# EAGLE design ZephMultiples (EAGLE 6.5.0)
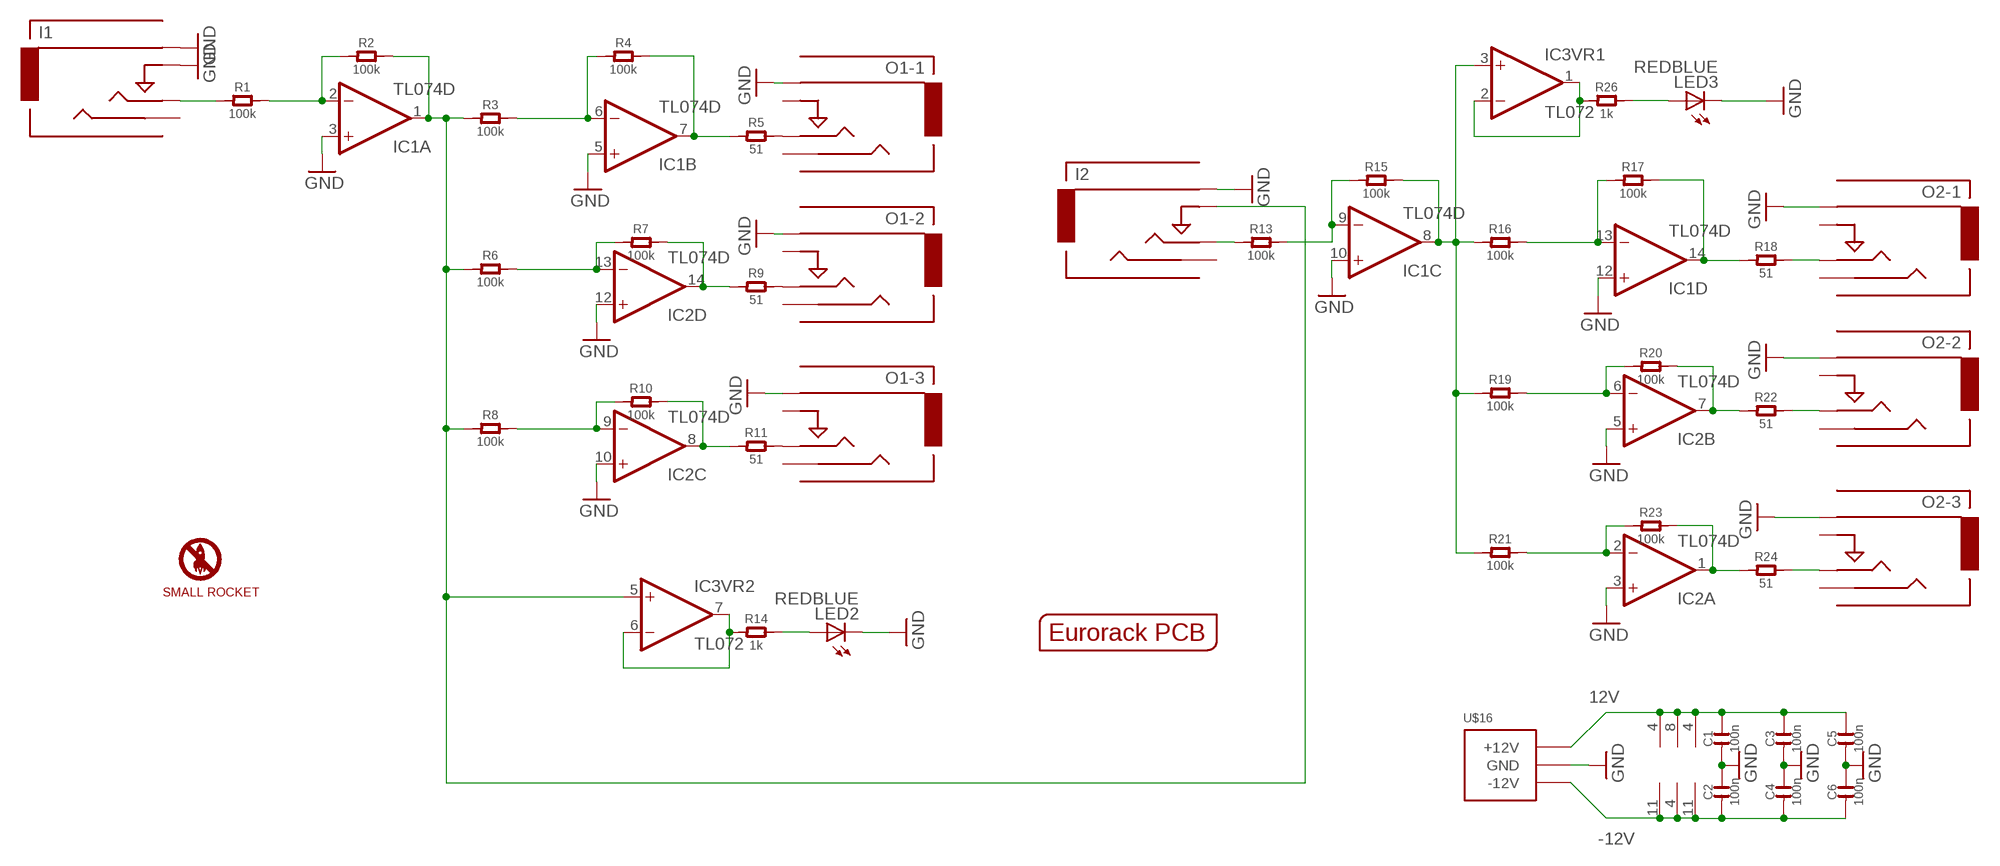
[diagram p0: schematic, sheet 1]

## Parts
C1  100n  C-0603  [C0603]
C2  100n  C-0603  [C0603]
C3  100n  C-0603  [C0603]
C4  100n  C-0603  [C0603]
C5  100n  C-0603  [C0603]
C6  100n  C-0603  [C0603]
I1  In 1  AUDIO-JACKINPUT  [3.5MM-JACK-SWITCH-13MM-INPUT]
I2  In 2  AUDIO-JACKINPUT  [3.5MM-JACK-SWITCH-13MM-INPUT]
IC1  TL074D  [SO14]
IC2  TL074D  [SO14]
IC3  TL072  [SO08]
LED2  REDBLUE  LED3MM  [LED3MM]
LED3  REDBLUE  LED3MM  [LED3MM]
O1-1  AUDIO-JACKOUTPUT  [3.5MM-JACK-SWITCH-13MM-OUTPUT]
O1-2  AUDIO-JACKOUTPUT  [3.5MM-JACK-SWITCH-13MM-OUTPUT]
O1-3  AUDIO-JACKOUTPUT  [3.5MM-JACK-SWITCH-13MM-OUTPUT]
O2-1  AUDIO-JACKOUTPUT  [3.5MM-JACK-SWITCH-13MM-OUTPUT]
O2-2  AUDIO-JACKOUTPUT  [3.5MM-JACK-SWITCH-13MM-OUTPUT]
O2-3  AUDIO-JACKOUTPUT  [3.5MM-JACK-SWITCH-13MM-OUTPUT]
R1  100k  R-0603  [R0603]
R2  100k  R-0603  [R0603]
R3  100k  R-0603  [R0603]
R4  100k  R-0603  [R0603]
R5  51  R-0603  [R0603]
R6  100k  R-0603  [R0603]
R7  100k  R-0603  [R0603]
R8  100k  R-0603  [R0603]
R9  51  R-0603  [R0603]
R10  100k  R-0603  [R0603]
R11  51  R-0603  [R0603]
R13  100k  R-0603  [R0603]
R14  1k  R-0603  [R0603]
R15  100k  R-0603  [R0603]
R16  100k  R-0603  [R0603]
R17  100k  R-0603  [R0603]
R18  51  R-0603  [R0603]
R19  100k  R-0603  [R0603]
R20  100k  R-0603  [R0603]
R21  100k  R-0603  [R0603]
R22  51  R-0603  [R0603]
R23  100k  R-0603  [R0603]
R24  51  R-0603  [R0603]
R26  1k  R-0603  [R0603]
U$1  SMALLROCKET  [SMALLROCKET]
U$15  EURORACK_PCB4HP  [EURORACK4HPPCB]
U$16  POWER_SIMPLE10-OTHERSIDE  [POWER_10_LABELSOTHERSIDE]

## Nets
12V: C1.2 C3.2 C5.2 IC1.4(P:V+) IC2.4(P:V+) IC3.8(VR3:V+) U$16.9(+12V) U$16.10(+12V)
-12V: C2.1 C4.1 C6.1 IC1.11(P:V-) IC2.11(P:V-) IC3.4(VR3:V-) U$16.1(-12V) U$16.2(-12V)
GND: C1.1 C2.2 C3.1 C4.2 C5.1 C6.2 I1.RING@1(RING) I1.RING@2(RING) I1.SWITCH@1(SWITCH) I1.SWITCH@2(SWITCH) I2.RING@1(RING) I2.RING@2(RING) IC1.3(A:+IN) IC1.5(B:+IN) IC1.10(C:+IN) IC1.12(D:+IN) IC2.3(A:+IN) IC2.5(B:+IN) IC2.10(C:+IN) IC2.12(D:+IN) LED2.K(C) LED3.K(C) O1-1.RING@1(RING) O1-1.RING@2(RING) O1-2.RING@1(RING) O1-2.RING@2(RING) O1-3.RING@1(RING) O1-3.RING@2(RING) O2-1.RING@1(RING) O2-1.RING@2(RING) O2-2.RING@1(RING) O2-2.RING@2(RING) O2-3.RING@1(RING) O2-3.RING@2(RING) U$16.3(GND) U$16.4(GND) U$16.5(GND) U$16.6(GND) U$16.7(GND) U$16.8(GND)
LED2DRIVE: IC3.6(VR2:-IN) IC3.7(VR2:OUT) R14.1
LED3DRIVE: IC3.1(VR1:OUT) IC3.2(VR1:-IN) R26.1
N$1: I1.TIP@1(TIP) I1.TIP@2(TIP) R1.1
N$2: IC1.2(A:-IN) R1.2 R2.1
N$3: I2.SWITCH@1(SWITCH) I2.SWITCH@2(SWITCH) IC1.1(A:OUT) IC3.5(VR2:+IN) R2.2 R3.1 R6.1 R8.1
N$4: IC1.6(B:-IN) R3.2 R4.1
N$5: IC1.7(B:OUT) R4.2 R5.1
N$6: IC2.13(D:-IN) R6.2 R7.1
N$7: IC2.9(C:-IN) R8.2 R10.1
N$8: IC2.14(D:OUT) R7.2 R9.1
N$9: IC2.8(C:OUT) R10.2 R11.1
N$11: O1-1.TIP@1(TIP) O1-1.TIP@2(TIP) R5.2
N$12: O1-2.TIP@1(TIP) O1-2.TIP@2(TIP) R9.2
N$13: O1-3.TIP@1(TIP) O1-3.TIP@2(TIP) R11.2
N$14: I2.TIP@1(TIP) I2.TIP@2(TIP) R13.1
N$15: IC1.9(C:-IN) R13.2 R15.1
N$16: IC1.8(C:OUT) IC3.3(VR1:+IN) R15.2 R16.1 R19.1 R21.1
N$17: IC1.13(D:-IN) R16.2 R17.1
N$18: IC1.14(D:OUT) R17.2 R18.1
N$19: IC2.6(B:-IN) R19.2 R20.1
N$20: IC2.2(A:-IN) R21.2 R23.1
N$21: IC2.7(B:OUT) R20.2 R22.1
N$22: IC2.1(A:OUT) R23.2 R24.1
N$24: O2-1.TIP@1(TIP) O2-1.TIP@2(TIP) R18.2
N$25: O2-2.TIP@1(TIP) O2-2.TIP@2(TIP) R22.2
N$26: O2-3.TIP@1(TIP) O2-3.TIP@2(TIP) R24.2
N$29: LED2.A R14.2
N$30: LED3.A R26.2
Unconnected: I1.SECOND@1(SECOND) I1.SECOND@2(SECOND) I2.SECOND@1(SECOND) I2.SECOND@2(SECOND) O1-1.SECOND@1(SECOND) O1-1.SECOND@2(SECOND) O1-1.SWITCH@1(SWITCH) O1-1.SWITCH@2(SWITCH) O1-2.SECOND@1(SECOND) O1-2.SECOND@2(SECOND) O1-2.SWITCH@1(SWITCH) O1-2.SWITCH@2(SWITCH) O1-3.SECOND@1(SECOND) O1-3.SECOND@2(SECOND) O1-3.SWITCH@1(SWITCH) O1-3.SWITCH@2(SWITCH) O2-1.SECOND@1(SECOND) O2-1.SECOND@2(SECOND) O2-1.SWITCH@1(SWITCH) O2-1.SWITCH@2(SWITCH) O2-2.SECOND@1(SECOND) O2-2.SECOND@2(SECOND) O2-2.SWITCH@1(SWITCH) O2-2.SWITCH@2(SWITCH) O2-3.SECOND@1(SECOND) O2-3.SECOND@2(SECOND) O2-3.SWITCH@1(SWITCH) O2-3.SWITCH@2(SWITCH)

## Library data of the parts
C1-C6 = OPL:C*
I1 I2 O1-1-O1-3 O2-1-O2-3 = EurorackModularParts:AUDIO-JACK: Switching Mono 3.5mm Audio Jack from Erthenvar.
IC1 IC2 = EurorackModularParts:TL074: OP AMP
IC3 = EurorackModularParts:TL072
LED2 LED3 = SparkFun-LED:LED: LEDs Standard schematic elements and footprints for 5mm, 3mm, 1206, and 0603 sized LEDs. 5mm - Spark Fun Electronics SKU : COM-00529 (and others)
R1-R11 R13-R24 R26 = OPL:R*
U$1 = zephod-components:SMALLROCKET
U$15 = EurorackModularParts:EURORACK_PCB
U$16 = EurorackModularParts:POWER_SIMPLE

## Net classes
1 AUDIO: width 1.016 mm

## Board
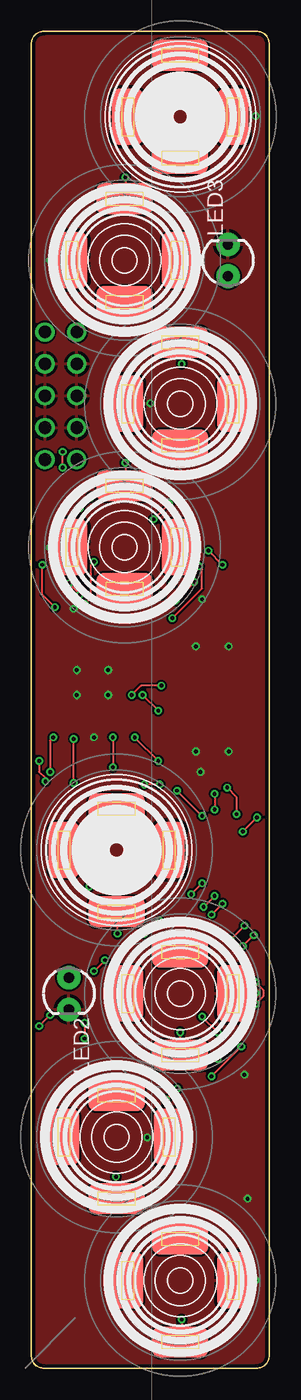
[diagram p1: board, top side]
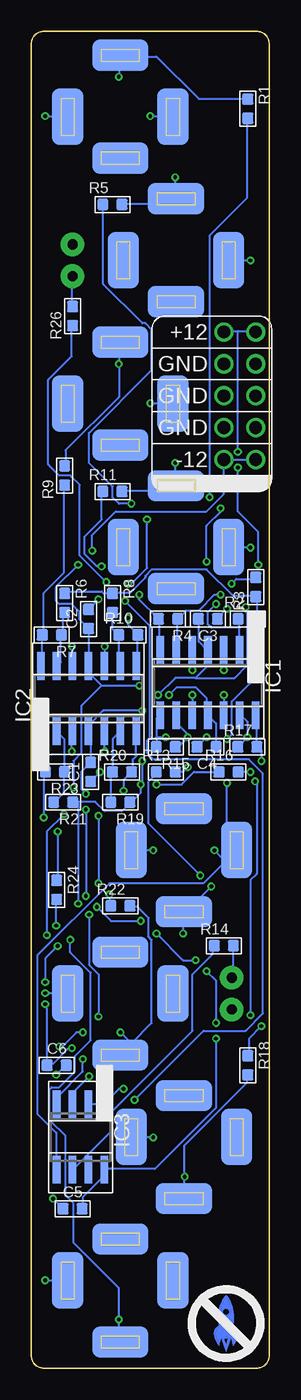
[diagram p2: board, bottom side, seen from below]

Size 18.98 x 106.5 mm. Coordinates in mm from the lower left corner, seen from the top.
Copper layers (1*16): Top 0.035mm / dielectric 1.5mm / Bottom 0.035mm
Design rules "ITEADstudio_DRC": minimum track width 6mil, minimum drill 12mil, track to track 6mil, track to pad 6mil, pad to pad 6mil, via to via 6mil, smd to smd 0mil, copper to edge 10mil, drill to drill 10mil, minimum pad ring 10mil, minimum via ring 6mil, stop-mask expansion 2mil, vias tented up to drill 100mil, thermal gap 10mil

### Footprints (pad centres in the part's own frame; a part is rotated, then mirrored left to right if it is on the bottom)
C0603 = smd 0.889 x 0.889: 1 -0.762,0; 2 0.762,0
3.5MM-JACK-SWITCH-13MM-INPUT = smd 2.5 x 4.5: RING@1 -4.2,0; SWITCH@1 4.2,0 | smd 2.5 x 4.5 bottom: RING@2 -4.2,0; SWITCH@2 4.2,0 | smd 4.5 x 2.5: SECOND@1 0,-3.3; TIP@1 0,4.9 | smd 4.5 x 2.5 bottom: SECOND@2 0,-3.3; TIP@2 0,4.9
SO14 = smd 0.6 x 2.2: 1 -3.81,-2.6; 2 -2.54,-2.6; 3 -1.27,-2.6; 4 0,-2.6; 5 1.27,-2.6; 6 2.54,-2.6; 7 3.81,-2.6; 8 3.81,2.6; 9 2.54,2.6; 10 1.27,2.6; 11 0,2.6; 12 -1.27,2.6; 13 -2.54,2.6; 14 -3.81,2.6
SO08 = smd 0.6 x 2.2: 1 -1.905,-2.6; 2 -0.635,-2.6; 3 0.635,-2.6; 4 1.905,-2.6; 5 1.905,2.6; 6 0.635,2.6; 7 -0.635,2.6; 8 -1.905,2.6
LED3MM = drill 0.813 pad 1.88: A -1.27,0; K 1.27,0
3.5MM-JACK-SWITCH-13MM-OUTPUT = smd 2.5 x 4.5: RING@1 -4.2,0; SWITCH@1 4.2,0 | smd 2.5 x 4.5 bottom: RING@2 -4.2,0; SWITCH@2 4.2,0 | smd 4.5 x 2.5: SECOND@1 0,-3.3; TIP@1 0,4.9 | smd 4.5 x 2.5 bottom: SECOND@2 0,-3.3; TIP@2 0,4.9
R0603 = smd 0.889 x 0.889: 1 -0.762,0; 2 0.762,0
POWER_10_LABELSOTHERSIDE = drill 1.016: 1 -5.08,-1.27; 2 -5.08,1.27; 3 -2.54,-1.27; 4 -2.54,1.27; 5 0,-1.27; 6 0,1.27; 7 2.54,-1.27; 8 2.54,1.27; 9 5.08,-1.27; 10 5.08,1.27

### Placement (x,y rotation side)
C1  14.25,47.5 90 bottom
C2  14.42,59.69 90 bottom
C3  4.89,59.69 180 bottom
C4  5,49.5 180 bottom
C5  15.69,12.7 0 bottom
C6  16.96,24.13 0 bottom
I1  11.88,99.69 0 top
I2  6.8,41.27 180 top
IC1  4.89,54.61 180 bottom
IC2  14.42,53.34 0 bottom
IC3  15.05,18.41 180 bottom
LED2  2.99,29.84 270 top
LED3  15.69,88.27 90 top
O1-1  7.44,88.27 0 top
O1-2  11.88,76.83 0 top
O1-3  7.44,65.41 0 top
O2-1  6.8,18.41 180 top
O2-2  11.88,29.84 180 top
O2-3  11.88,6.99 180 top
R1  1.72,100.33 270 bottom
R2  1.72,59.69 0 bottom
R3  1.09,62.23 90 bottom
R4  8.07,59.69 180 bottom
R5  12.52,92.71 0 bottom
R6  16.32,60.96 270 bottom
R7  17.34,58.42 180 bottom
R8  12.52,60.96 270 bottom
R9  16.32,71.12 90 bottom
R10  11.24,58.42 0 bottom
R11  12.52,69.85 0 bottom
R13  8.25,47.5 0 bottom
R14  3.62,33.66 0 bottom
R15  8.25,49.5 180 bottom
R16  3.25,47.5 0 bottom
R17  1.75,49.5 0 bottom
R18  1.72,24.13 270 bottom
R19  11.88,45.09 180 bottom
R20  11.75,47.5 0 bottom
R21  16.44,45.09 180 bottom
R22  11.88,36.83 0 bottom
R23  17.09,47.51 180 bottom
R24  16.96,38.1 270 bottom
R26  15.69,83.82 90 bottom
U$1  3.75,3.25 0 bottom
U$15  -0.5,0 0 top
U$16  2.36,77.47 90 bottom

### Tracks (layer width: path | path; a pad name or v marks a point on that pad's centre or on a via)
12V  (via drill 0.3)
  Top 0.152: v8.88,53.62 v10.12,52.38 | v4.25,27.5 v4.25,26.25 | v5.88,32.5 v5,31.62 | v9,34.62 9.25,34.62 v10.25,35.62 | v14.62,37.62 v13.75,36.75 | v14.62,45.75 v14.62,44.5 | v2.5,71.75 v2.5,73 | v0.88,64 0.88,61.62 v1.88,60.62
  Bottom 0.152: 2.5,82.62 3.62,82.62 U$16.10 | 2.5,82.62 1.12,82.62 U$16.9 | C5.2 14.88,12.75 14.88,13.62 13.25,15.25 13.25,15.75 IC3.8 13.12,15.88 9.12,15.88 4.25,20.75 v4.25,26.25 | C3.2 5.62,59.62 5.62,57.88 5,57.25 IC1.4 5,57.12 5,55.88 5.88,55 | v10.12,52.38 13.25,52.38 14.38,51.25 14.38,50.75 IC2.4 14.38,50.62 14.25,50.5 C1.2 15,47.5 15,46.12 v14.62,45.75 | v8.88,53.62 7.5,55 5.88,55 | v4.25,27.5 4.25,30.88 v5,31.62 | v5.88,32.5 6.88,32.5 v9,34.62 | v10.25,35.62 12.62,35.62 v13.75,36.75 | v14.62,44.5 v14.62,37.62 | v2.5,73 2.5,82.62 | v2.5,71.75 2.5,68.25 0.88,66.62 v0.88,64 | v1.88,60.62 1.88,60.25 1.75,60.12 1.75,56 2.75,55 5.88,55
-12V  (via drill 0.3)
  Top 0.152: v14.88,24.62 v15.75,25.5 | v8,53.62 8.75,54.38 v10.38,54.38 | v17.88,29 18.5,29.62 18.5,30.12 v17.88,30.75 | v17.75,34.5 v16.88,33.62 | v16.38,44.12 16.38,45.5 v15.62,46.25 | v15.25,64 v14.12,65.12
  Bottom 0.152: 3.62,72.38 1.12,72.38 U$16.1 | v15.75,25.5 16,25.5 17.25,24.25 17.62,24.25 C6.1 17.75,24.25 17.75,28.88 v17.88,29 | v14.88,24.62 14.88,23.62 16.88,21.62 16.88,21.12 IC3.4 | C4.1 4.25,51.38 4.88,52 IC1.11 5,52.12 5,53.38 5.88,54.25 7.38,54.25 v8,53.62 | 13.38,54.38 v10.38,54.38 | 13.38,54.38 14.38,55.38 14.38,55.88 IC2.11 14.38,56 14.38,58.88 C2.1 14.5,59 15.12,59.62 15.12,60.25 15.75,60.88 16.75,60.88 17,61.12 17,62.25 v15.25,64 | v17.88,30.75 17.88,32.62 v16.88,33.62 | v17.75,34.5 17.75,42.75 v16.38,44.12 | v15.62,46.25 15.62,48.38 15,49 15,52.75 13.38,54.38 | 3.62,72.38 3.62,69.62 5,68.25 12.25,68.25 14.12,66.38 v14.12,65.12 | 3.62,72.38 U$16.2
GND  (via drill 0.3)
  Bottom 0.152: v5,50.25 C4.2 | v13.5,47.5 C1.1 | v3.38,60.5 4.12,59.75 C3.1 | v13.62,61.25 14.38,60.5 C2.2 | v17.25,13.5 16.5,12.75 C5.1 | v17,23.38 16.25,24.12 C6.2 | v3.62,53.62 IC1.12 | v13.12,49.12 13.12,50.62 IC2.5 | v3.62,55.62 IC1.3 | v6.12,53.62 6.12,52.12 IC1.10 | v6.12,55.62 6.12,57.12 IC1.5 | v15.75,49.12 15.75,50.62 IC2.3 | v13.12,57.5 13.12,56 IC2.10 | v15.75,57.5 15.75,56 IC2.12 | v17.88,7 16.12,7 O2-3.RING@1 | v9.25,18.38 11,18.38 O2-1.RING@1 | v17.88,29.88 16.12,29.88 O2-2.RING@1 | v9.25,41.25 11,41.25 I2.RING@1 | v1.5,65.38 3.12,65.38 O1-3.RING@1 | v9.5,76.88 7.75,76.88 O1-2.RING@1 | v1.5,88.25 3.12,88.25 O1-1.RING@1 | v9.5,99.75 7.75,99.75 I1.RING@1 | v17.88,99.75 16.12,99.75 I1.SWITCH@2
  pour Top: -0.89,107.14 20.2,107.14 19.57,-0.64 -0.89,-0.64
LED2DRIVE
  Bottom 0.152: 14.5,17 15.62,15.88 IC3.6 | 14.5,17 12.5,19 12.5,20.5 6.12,26.88 6.12,31.38 4.5,33 4.5,33.62 R14.1 | 14.5,17 14.5,15.88 IC3.7
LED3DRIVE  (via drill 0.3)
  Top 0.152: v11.5,61.12 v13,62.62 | v11.62,22.25 v10.75,21.38
  Bottom 0.152: v13,62.62 15.12,64.75 15.12,70.38 15.88,71.12 16.75,71.12 17.62,72 17.62,78.75 15.75,80.62 15.75,83 R26.1 | v11.5,61.12 9.5,59.12 9.5,50.25 9.75,50 9.75,49 9.25,48.5 1.62,48.5 0.5,47.38 0.5,28.25 1.88,26.88 5.25,26.88 v10.75,21.38 | v11.62,22.25 12,22.25 13.12,21.12 IC3.1 13.25,21 14.38,21 IC3.2
N$1  (via drill 0.3)
  Top 0.152: v12,102.88 12,104.5 I1.TIP@2
  Bottom 0.152: R1.1 1.75,101.12 5.62,101.12 9,104.5 11.88,104.5 I1.TIP@2 12,104.5 v12,102.88
N$2  (via drill 0.3)
  Top 0.152: v3.88,68.5 v4.75,69.38 | v5,64.25 4.75,64 4.75,61.38 v4.25,60.88
  Bottom 0.152: 2.38,59 2.38,57.25 IC1.2 | 2.38,59 2.38,59.62 R2.1 | v4.75,69.38 4.75,90.25 1.75,93.25 1.75,99.5 R1.2 | v3.88,68.5 3.88,68.25 5,67.12 v5,64.25 | v4.25,60.88 4.88,60.25 4.88,59.25 4.62,59 2.38,59
N$3  (via drill 0.3)
  Top 0.152: v4.38,41.25 2.62,41.25 I2.SWITCH@2 | v3.38,46.62 v3.38,50.12
  Bottom 0.152: R6.1 16.25,61.75 16.12,61.88 13.38,61.88 13.25,61.75 12.62,61.75 R8.1 12.5,61.75 11.12,61.75 9.88,63 9.88,63.12 9.38,63.62 5,63.62 2.88,61.5 1.12,61.5 R3.1 1,61.38 1,59.75 R2.2 1,59.62 1,57.25 IC1.1 1.12,57.12 1.12,55 3,53.12 3,50.5 v3.38,50.12 | 3.38,40.5 2.62,41.25 I2.SWITCH@2 | 3.5,40.38 5.25,38.62 12.75,38.62 18.5,32.88 18.5,20.25 17,18.75 17,15.88 IC3.5 | 3.5,40.38 v4.38,41.25 | 3.5,40.38 3.38,40.5 | 3.38,40.5 v3.38,46.62
N$4  (via drill 0.3)
  Top 0.152: v3.88,61.62 v3,62.5
  Bottom 0.152: v3,62.5 2.62,62.88 1.12,62.88 R3.2 | v3.88,61.62 4.38,61.62 5.62,60.38 6.62,60.38 7.25,59.75 R4.1 7.38,59.62 7.38,57.25 IC1.6
N$5  (via drill 0.3)
  Top 0.152: v9.75,67.62 v11,68.88 | v10.38,61.62 v11.25,62.5
  Bottom 0.152: IC1.7 8.75,57.25 8.75,59.62 R4.2 8.88,59.75 10.38,61.25 v10.38,61.62 | v11,68.88 12,68.88 12.5,69.38 12.5,70.25 14.38,72.12 14.38,74.5 9.38,79.5 9.38,82.75 9.88,83.25 10.12,83.25 13.25,86.38 13.25,92.62 R5.1 | v9.75,67.62 9.75,63.75 11,62.5 v11.25,62.5
N$6
  Bottom 0.152: R6.2 16.38,60.12 16.5,60 16.5,58.5 R7.1 16.62,58.38 16.62,56.25 16.88,56 IC2.13
N$7
  Bottom 0.152: IC2.9 12,56 12,58.38 R10.1 12.12,58.5 12.5,58.88 12.5,60.12 R8.2
N$8
  Bottom 0.152: IC2.14 18.12,56 18.12,58.38 R7.2 18,58.5 18,61.75 16.38,63.38 16.38,70.25 R9.1
N$9  (via drill 0.3)
  Top 0.152: v13.38,63.88 13.62,63.62 13.62,62.12 v11.25,59.75
  Bottom 0.152: IC2.8 10.5,56 10.5,58.38 R10.2 10.5,58.5 11.25,59.25 v11.25,59.75 | v13.38,63.88 13.75,63.88 14.75,64.88 14.75,66.25 13.38,67.62 13.38,69.75 R11.1
N$11  (via drill 0.3)
  Top 0.152: v7.5,94.88 7.5,93.25 O1-1.TIP@1
  Bottom 0.152: R5.2 11.75,92.75 7.88,92.75 7.5,93.12 O1-1.TIP@1 7.5,93.25 v7.5,94.88
N$12  (via drill 0.3)
  Top 0.152: v12,80 12,81.62 O1-2.TIP@1
  Bottom 0.152: R9.2 16.25,72 16.25,73.12 12,77.38 v12,80 12,81.62 O1-2.TIP@1
N$13  (via drill 0.3)
  Top 0.152: v7.5,72.12 7.5,70.38 O1-3.TIP@1
  Bottom 0.152: R11.2 11.75,69.88 7.88,69.88 7.5,70.25 O1-3.TIP@1 7.5,70.38 v7.5,72.12
N$14  (via drill 0.3)
  Top 0.152: v4.62,38.38 v5.5,39.25 | v6.88,34.62 6.88,36.38 I2.TIP@2
  Bottom 0.152: v5.5,39.25 9.62,43.38 9.62,46.75 9.12,47.25 9.12,47.5 R13.1 | v4.62,38.38 6.62,36.38 I2.TIP@2 6.88,36.38 v6.88,34.62
N$15  (via drill 0.3)
  Top 0.152: v6.5,50.25 v6.5,47.88
  Bottom 0.152: R13.2 6.88,47.5 v6.5,47.88 | R15.1 7.25,49.5 v6.5,50.25 6.5,50.5 7.38,51.38 7.38,52 IC1.9
N$16  (via drill 0.3)
  Top 0.152: v10.25,46.5 v9,46.5 | v16.75,25.62 v14.38,23.25 | v13.62,28 v14.88,26.75 | v15.25,37 v14.38,36.12 | v10.12,48.38 v8.25,50.25
  Bottom 0.152: 9,50.25 9,51.75 8.75,52 IC1.8 | 9,50.25 R15.2 | R16.1 6,47.5 7,46.5 v9,46.5 | 15.25,45.12 13.88,45.12 13.12,44.38 11.75,44.38 11.12,45 R19.1 11,45.12 10.25,45.88 v10.25,46.5 10.12,46.62 v10.12,48.38 | 15.25,45.12 15.62,45.12 R21.1 15.25,45.12 | v14.38,23.25 15.62,22 15.62,21.12 IC3.3 | v16.75,25.62 16.5,25.62 15.38,26.75 v14.88,26.75 | v13.62,28 13.62,31.38 14.38,32.12 v14.38,36.12 | 15.25,45.12 v15.25,37 | v8.25,50.25 9,50.25
N$17  (via drill 0.3)
  Top 0.152: v1.5,47.5 1.5,50 v1.75,50.25
  Bottom 0.152: v1.5,47.5 R16.2 | R17.1 v1.75,50.25 1.75,51.5 2.25,52 IC1.13
N$18  (via drill 0.3)
  Top 0.152: v1.5,28.12 v0.62,27.25 | v1.12,46.75 1.12,47 0.62,47.5 v0.62,48.38
  Bottom 0.152: v0.62,27.25 1.62,26.25 1.62,25 R18.1 | v1.5,28.12 1.5,38.88 1,39.38 1,46.62 v1.12,46.75 | v0.62,48.38 0.62,49.25 0.88,49.5 R17.2 1,52 IC1.14
N$19
  Bottom 0.152: R19.2 12.62,45.12 12.62,47.5 R20.1 12.5,50.12 12,50.62 IC2.6
N$20
  Bottom 0.152: R21.2 17.12,45.12 16.38,45.88 16.38,47.5 R23.1 16.38,47.62 16.38,50.12 16.88,50.62 IC2.2
N$21  (via drill 0.3)
  Top 0.152: v13.62,38.62 v12.75,37.75 | v11.62,46 v13.62,44
  Bottom 0.152: v12.75,37.75 12.75,36.88 R22.1 | v13.62,44 v13.62,38.62 | v11.62,46 11.62,46.88 R20.2 10.88,47.5 10.88,48.5 10.62,48.75 10.62,50.62 IC2.7
N$22  (via drill 0.3)
  Top 0.152: v18,43.88 v16.88,42.75
  Bottom 0.152: v16.88,42.75 16.88,38.88 R24.1 | v18,43.88 18,47.38 17.88,47.5 R23.2 17.88,47.62 18.12,47.88 18.12,50.62 IC2.1
N$24  (via drill 0.3)
  Top 0.152: v6.75,15.25 6.75,13.62 O2-1.TIP@1
  Bottom 0.152: R18.2 1.75,23.25 1.75,22.75 6.75,17.75 v6.75,15.25 6.75,13.62 O2-1.TIP@1
N$25  (via drill 0.3)
  Top 0.152: v11.88,26.75 11.88,25 O2-2.TIP@1
  Bottom 0.152: 11,25.88 11.88,25 O2-2.TIP@1 11,25.88 | 11,25.88 9.38,27.5 9.38,34.12 9.62,34.38 9.62,35.88 10.5,36.75 11,36.75 R22.2 | 11,25.88 v11.88,26.75
N$26  (via drill 0.3)
  Top 0.152: v15.88,34.12 v17,35.25 | v12,3.88 12,2.12 O2-3.TIP@1
  Bottom 0.152: v17,35.25 17,37.25 R24.2 | v15.88,34.12 15.88,33.12 14.25,31.5 14.25,26.12 15.5,24.88 15.5,23.62 16.75,22.38 17.38,22.38 17.5,22.25 17.5,19.75 16.25,18.5 16.25,13.75 15.62,13.12 15.62,10 12,6.38 v12,3.88 12,2.12 O2-3.TIP@1
N$29
  Bottom 0.152: R14.2 2.88,33.62 2.88,31.12 LED2.A
N$30
  Bottom 0.152: R26.2 15.75,84.62 15.75,86.88 LED3.A